# Altium schematic sheet MCU.SchDoc
size A3; SheetNumber: 6; SheetTotal: 7
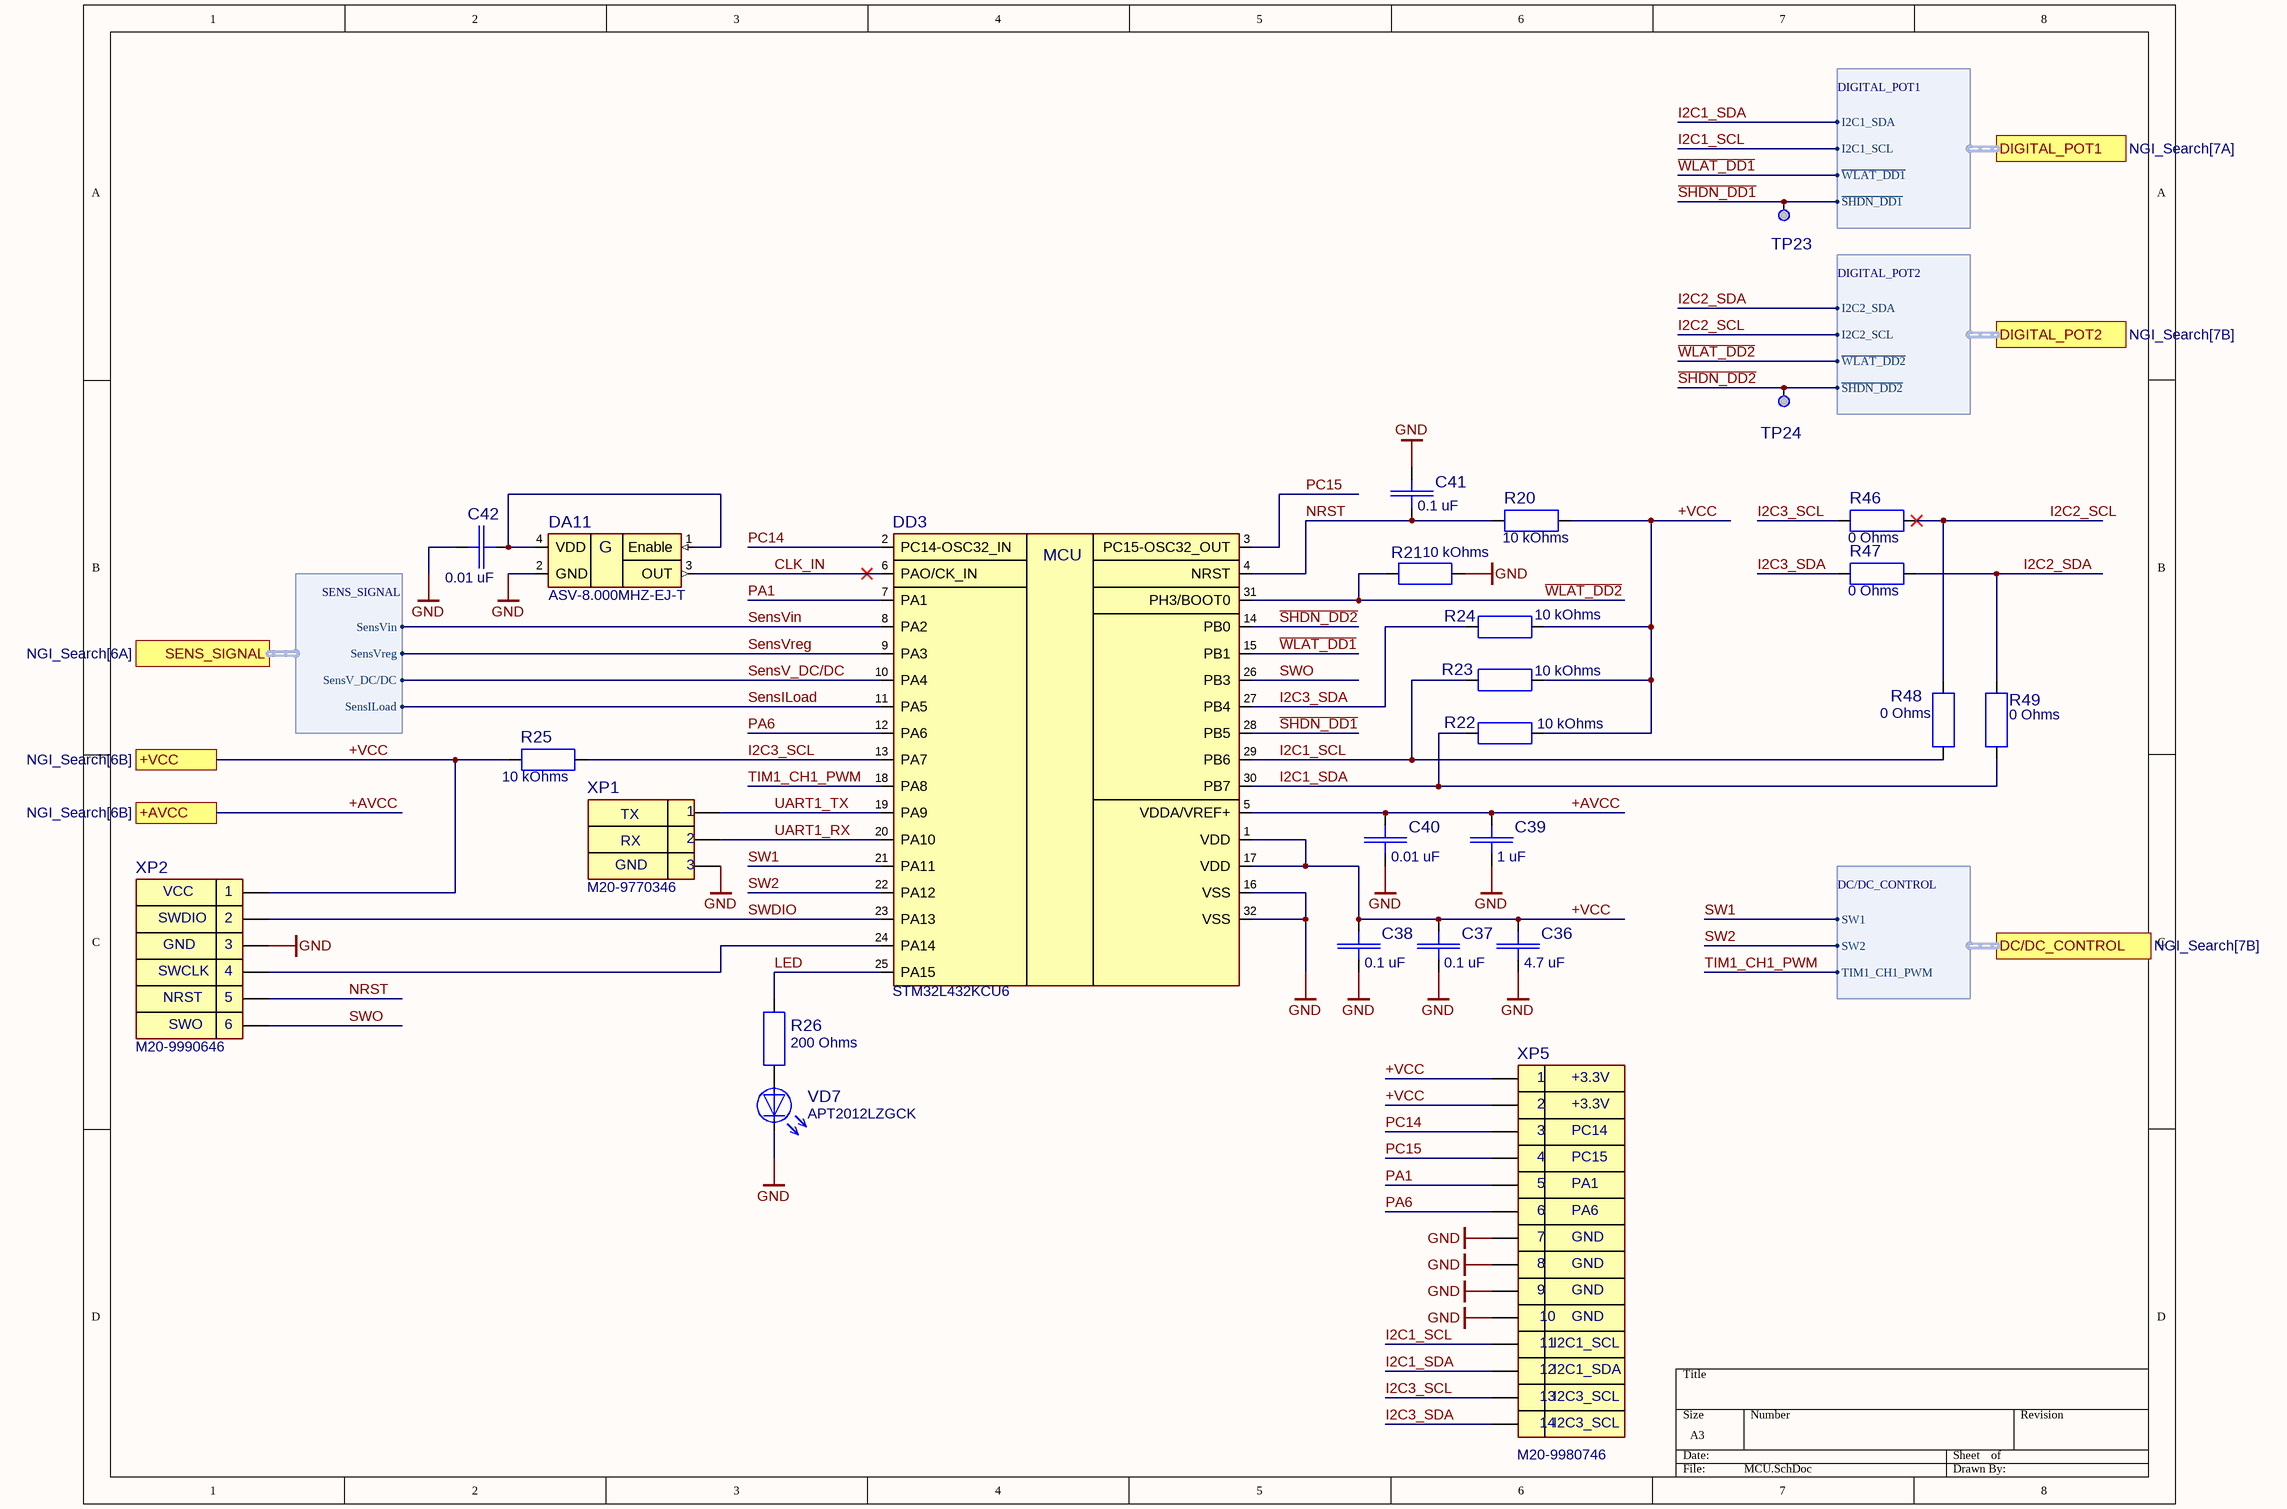
[diagram p0: MCU.SchDoc]

## Parts
C36  value 4.7 uF  [Capacitor0805_THICKNESS1.25]  (hidden comment: CL21A475KAQNNNF)
C37  value 0.1 uF  [Capacitor0805_THICKNESS0.8]  (hidden comment: CL21B104KBCNNWC)
C38  value 0.1 uF  [Capacitor0805_THICKNESS0.8]  (hidden comment: CL21B104KBCNNWC)
C39  value 1 uF  [Capacitor0805_THICKNESS1.25]  (hidden comment: CL21B105KAFNFNE)
C40  value 0.01 uF  [Capacitor0805_THICKNESS0.8]  (hidden comment: CL21B103KBANNNL)
C41  value 0.1 uF  [Capacitor0805_THICKNESS0.8]  (hidden comment: CL21B104KBCNNWC)
C42  value 0.01 uF  [Capacitor0805_THICKNESS0.8]  (hidden comment: CL21B103KBANNNL)
DA11  ASV-8.000MHZ-EJ-T  [HCMOS 7 mm x 5 mm]
DD3  STM32L432KCU6  [UFQFPN-32]
R20  value 10 kOhms  [Resistor0805_THICKNESS0.6]  (hidden comment: RC0805FR-0710KL)
R21  value 10 kOhms  [Resistor0805_THICKNESS0.6]  (hidden comment: RC0805FR-0710KL)
R22  value 10 kOhms  [Resistor0805_THICKNESS0.6]  (hidden comment: RC0805FR-0710KL)
R23  value 10 kOhms  [Resistor0805_THICKNESS0.6]  (hidden comment: RC0805FR-0710KL)
R24  value 10 kOhms  [Resistor0805_THICKNESS0.6]  (hidden comment: RC0805FR-0710KL)
R25  value 10 kOhms  [Resistor0805_THICKNESS0.6]  (hidden comment: RC0805FR-0710KL)
R26  value 200 Ohms  [Resistor0805_THICKNESS0.6]  (hidden comment: RC0805FR-10200RL)
R46  value 0 Ohms  [Resistor0805_THICKNESS0.6]  (hidden comment: RC0805FR-070RL)
R47  value 0 Ohms  [Resistor0805_THICKNESS0.6]  (hidden comment: RC0805FR-070RL)
R48  value 0 Ohms  [Resistor0805_THICKNESS0.6]  (hidden comment: RC0805FR-070RL)
R49  value 0 Ohms  [Resistor0805_THICKNESS0.6]  (hidden comment: RC0805FR-070RL)
TP23  test point  [test point]  (value not drawn)
TP24  test point  [test point]  (value not drawn)
VD7  APT2012LZGCK  [APT2012LZGCK0805_LEDs]
XP1  M20-9770346  [3 VERTICAL PIN Pitch: 2.54 mm]
XP2  M20-9990646  [6 VERTICAL PIN Pitch: 2.54 mm]
XP5  M20-9980746  [M20-9980746]

## Ports
+AVCC (see NGI_Search[6B]), +VCC (see NGI_Search[6B]), DC/DC_CONTROL (harness DC/DC_CONTROL, see NGI_Search[7B]), DIGITAL_POT1 (harness DIGITAL_POT1, see NGI_Search[7A]), DIGITAL_POT2 (harness DIGITAL_POT2, see NGI_Search[7B]), SENS_SIGNAL (harness SENS_SIGNAL, see NGI_Search[6A])

## Harnesses
DIGITAL_POT1: I2C1_SDA, I2C1_SCL, ~{WLAT_DD1}, ~{SHDN_DD1}
DIGITAL_POT2: I2C2_SDA, I2C2_SCL, ~{WLAT_DD2}, ~{SHDN_DD2}
SENS_SIGNAL: SensVin, SensVreg, SensV_DC/DC, SensILoad
DC/DC_CONTROL: SW1, SW2, TIM1_CH1_PWM

## Nets
GND: C36.1 C37.1 C38.1 C39.1 C40.1 C41.1 C42.1 DA11.2(GND) DD3.16(VSS) DD3.32(VSS) R21.2 VD7.C XP1.3 XP2.3 XP5.7 XP5.8 XP5.9 XP5.10
+AVCC: C39.2 C40.2 DD3.5(VDDA/VREF+) ; port +AVCC
+VCC: C36.2 C37.2 C38.2 DD3.1(VDD) DD3.17(VDD) R20.2 R22.1 R23.2 R24.1 R25.1 XP2.1 XP5.1 XP5.2 ; port +VCC
CLK_IN: DA11.3(OUT) DD3.6(PAO/CK_IN)
I2C1_SCL: DD3.29(PB6) R23.1 R48.1 XP5.11 ; port DIGITAL_POT1.I2C1_SCL
I2C1_SDA: DD3.30(PB7) R22.2 R49.1 XP5.12 ; port DIGITAL_POT1.I2C1_SDA
I2C2_SCL: R46.2 R48.2 ; port DIGITAL_POT2.I2C2_SCL
I2C2_SDA: R47.2 R49.2 ; port DIGITAL_POT2.I2C2_SDA
I2C3_SCL: DD3.13(PA7) R25.2 R46.1 XP5.13
I2C3_SDA: DD3.27(PB4) R24.2 R47.1 XP5.14
LED: DD3.25(PA15) R26.2
NRST: C41.2 DD3.4(NRST) R20.1 XP2.5
PA1: DD3.7(PA1) XP5.5
PA6: DD3.12(PA6) XP5.6
PC14: DD3.2(PC14-OSC32_IN) XP5.3
PC15: DD3.3(PC15-OSC32_OUT) XP5.4
~{SHDN_DD1}: DD3.28(PB5) TP23.1 ; port DIGITAL_POT1.~{SHDN_DD1}
~{SHDN_DD2}: DD3.14(PB0) TP24.1 ; port DIGITAL_POT2.~{SHDN_DD2}
SensILoad: DD3.11(PA5) ; port SENS_SIGNAL.SensILoad
SensV_DC/DC: DD3.10(PA4) ; port SENS_SIGNAL.SensV_DC/DC
SensVin: DD3.8(PA2) ; port SENS_SIGNAL.SensVin
SensVreg: DD3.9(PA3) ; port SENS_SIGNAL.SensVreg
SW1: DD3.21(PA11) ; port DC/DC_CONTROL.SW1
SW2: DD3.22(PA12) ; port DC/DC_CONTROL.SW2
SWDIO: DD3.23(PA13) XP2.2
SWO: DD3.26(PB3) XP2.6
TIM1_CH1_PWM: DD3.18(PA8) ; port DC/DC_CONTROL.TIM1_CH1_PWM
UART1_RX: DD3.20(PA10) XP1.2
UART1_TX: DD3.19(PA9) XP1.1
~{WLAT_DD1}: DD3.15(PB1) ; port DIGITAL_POT1.~{WLAT_DD1}
~{WLAT_DD2}: DD3.31(PH3/BOOT0) R21.1 ; port DIGITAL_POT2.~{WLAT_DD2}
NetC42_2: C42.2 DA11.1(Enable) DA11.4(VDD)
NetDD3_24: DD3.24(PA14) XP2.4
NetR26_1: R26.1 VD7.A

## Notes on the sheet
- TX
- RX
- (near XP2) SWDIO
- VCC
- GND
- (near XP2) SWCLK
- (near XP2) NRST
- (near XP2) SWO
- (near XP5) +3.3V
- (near XP5) PC14
- (near XP5) PC15
- (near XP5) PA1
- (near XP5) PA6
- (near XP5) GND
- (near XP5) I2C1_SCL
- (near XP5) I2C1_SDA
- (near XP5) I2C3_SCL
- (in symbol ASV-8.000MHZ-EJ-T) G
- (in symbol STM32L432KCU6) MCU

## Library data of the parts
C36 = CL21A475KAQNNNF: Multilayer Ceramic Capacitors MLCC - SMD/SMT 4.7uF+/-10% 25V X5R 0805; Manufacturer: Samsung Electro-Mechanics; Tolerance: 10%; Case: 0805; Datasheet Link: https://eu.mouser.com/datasheet/2/585/MLCC-1837944.pdf; Dielectric: X5R; ManufacturerPartNumber: CL21A475KAQNNNF; Mouser Part Number: 187-CL21A475KAQNNNF; Mouser Price/Stock: https://eu.mouser.com/ProductDetail/Samsung-Electro-Mechanics/CL21A475KAQNNNF?qs=sGAEpiMZZMvsSlwiRhF8qtsGU%2FCnaNeQ9%2FtqxdEQLsBh1lK0%252BjEvRQ%3D%3D; Power/Voltage: 25V
C37 C38 C41 = CL21B104KBCNNWC: Multilayer Ceramic Capacitors MLCC - SMD/SMT 100nF+/-10% 50V X7R 0805; Manufacturer: Samsung Electro-Mechanics; Tolerance: 10%; Dielectric: X7R; ManufacturerPartNumber: CL21B104KBCNNWC; Mouser Price/Stock: https://eu.mouser.com/ProductDetail/Samsung-Electro-Mechanics/CL21B104KBCNNWC?qs=yOVawPpwOwlu2UTVxWhmlw%3D%3D; Power/Voltage: 50V; Case: 0805; Datasheet Link: https://eu.mouser.com/datasheet/2/585/MLCC-1837944.pdf; Mouser Part Number: 187-CL21B104KBCNNWC
C39 = CL21B105KAFNFNE: Multilayer Ceramic Capacitors MLCC - SMD/SMT 1uF+/-10% 25V X7R 20 0805; Manufacturer: Samsung Electro-Mechanics; Tolerance: 10%; Case: 0805; Datasheet Link: https://eu.mouser.com/datasheet/2/585/MLCC-1837944.pdf; Dielectric: X7R; ManufacturerPartNumber: CL21B105KAFNFNE; Mouser Part Number: 187-CL21B105KAFNFNE; Mouser Price/Stock: https://eu.mouser.com/ProductDetail/Samsung-Electro-Mechanics/CL21B105KAFNFNE?qs=%252B6g0mu59x7LIqMOGGtEcpA%3D%3D; Power/Voltage: 25V
C40 C42 = CL21B103KBANNNL: Multilayer Ceramic Capacitors MLCC - SMD/SMT 10nF+/-10% 50V X7R 2 0805; Manufacturer: Samsung Electro-Mechanics; Tolerance: 10%; Case: 0805; Datasheet Link: https://eu.mouser.com/datasheet/2/585/MLCC-1837944.pdf; Dielectric: X7R; ManufacturerPartNumber: CL21B103KBANNNL; Mouser Part Number: 187-CL21B103KBANNNL; Mouser Price/Stock: https://eu.mouser.com/ProductDetail/Samsung-Electro-Mechanics/CL21B103KBANNNL?qs=sGAEpiMZZMvsSlwiRhF8qtsGU%2FCnaNeQUbGZYi74bLm5gwqVLR8V4A%3D%3D; Power/Voltage: 50V
DA11 = ASV-8.000MHZ-EJ-T: Standard Clock Oscillators XTAL OSC XO 8.0000MHZ HCMOS SMD; Manufacturer: ABRACON; Value: 8 Mhz; Case: HCMOS 7 mm x 5 mm; Datasheet Link: https://eu.mouser.com/datasheet/2/3/ASV-3106233.pdf; ManufacturerPartNumber: ASV-8.000MHZ-EJ-T; Mouser Part Number: 815-ASV-8-EJ-T; Mouser Price/Stock: https://eu.mouser.com/ProductDetail/ABRACON/ASV-8.000MHZ-EJ-T?qs=2xLVn2jvFusvDzqul0mkiw%3D%3D
DD3 = STM32L432KCU6: ARM Microcontrollers - MCU Ultra-low-power FPU Arm Cortex-M4 MCU 80 MHz 256 Kbytes of Flash , USB; Manufacturer: STMicroelectronics; Case: UFQFPN-32; Datasheet Link: https://eu.mouser.com/datasheet/2/389/stm32l432kb-1851151.pdf; ManufacturerPartNumber: STM32L432KCU6; Mouser Part Number: 511-STM32L432KCU6; Mouser Price/Stock: https://eu.mouser.com/ProductDetail/STMicroelectronics/STM32L432KCU6?qs=dTJS0cRn7oiybcTRwI97Tw%3D%3D
R20-R25 = RC0805FR-0710KL: Thick Film Resistors 10 kOhms 125 mW 0805 1%; Manufacturer: YAGEO; Power/Voltage: 125 mW / 150V; Case: 0805; Datasheet Link: https://eu.mouser.com/datasheet/2/447/YAGEO_PYu_RC_Group_51_RoHS_L_12-3313492.pdf; ManufacturerPartNumber: RC0805FR-0710KL; Mouser Part Number: 603-RC0805FR-0710KL; Mouser Price/Stock: https://eu.mouser.com/ProductDetail/YAGEO/RC0805FR-0710KL?qs=sGAEpiMZZMvdGkrng054txdMlaQGj9fi4uZGpN02qIo%3D; Tolerance: 1%
R26 = RC0805FR-10200RL: Thick Film Resistors 200Ohms 1/8W 0805 1%; Manufacturer: YAGEO; Power/Voltage: 125 mW / 150V; Case: 0805; Datasheet Link: https://www.yageo.com/upload/media/product/productsearch/datasheet/rchip/PYu-RC_Group_51_RoHS_L_12.pdf; ManufacturerPartNumber: RC0805FR-10200RL; Mouser Price/Stock: https://eu.mouser.com/ProductDetail/YAGEO/RC0805FR-10200RL?qs=sGAEpiMZZMvdGkrng054t7z4BkURc4LzuHPKHxVOSmZu%252BG%252BXJlK7UA%3D%3D; Tolerance: 1%; Mouser Part Number: 603-RC0805FR-10200RL
R46-R49 = RC0805FR-070RL: Thick Film Resistors 0 Ohms 125 mW 0805 1%; Manufacturer: YAGEO; Power/Voltage: 125 mW / 150V; Case: 0805; Datasheet Link: https://eu.mouser.com/datasheet/2/447/YAGEO_PYu_RC_Group_51_RoHS_L_12-3313492.pdf; ManufacturerPartNumber: RC0805FR-070RL; Mouser Part Number: 603-RC0805FR-070RL; Mouser Price/Stock: https://eu.mouser.com/ProductDetail/YAGEO/RC0805FR-070RL?qs=sGAEpiMZZMvdGkrng054tx7%2F6%252BNA3LAJ3XU3yVJUh88%3D; Tolerance: 1%
VD7 = APT2012LZGCK: Standard LEDs - SMD 2.0X1.2MM LOW CRNT; Manufacturer: Kingbright; Case: 0805; ManufacturerPartNumber: APT2012LZGCK; Mouser Part Number: 604-APT2012LZGCK; Mouser Price/Stock: https://eu.mouser.com/ProductDetail/Kingbright/APT2012LZGCK?qs=6oMev5NRZMHOosFiXb%2F3qw%3D%3D; Datasheet Link: https://eu.mouser.com/datasheet/2/216/APT2012LZGCK-535687.pdf
XP1 = M20-9770346: Headers & Wire Housings 03 SIL VERTICAL PIN HEADER TIN; Manufacturer: Harwin; Case: 3 VERTICAL PIN Pitch: 2.54 mm; Datasheet Link: https://eu.mouser.com/datasheet/2/181/M20-977-1220590.pdf; ManufacturerPartNumber: M20-9770346; Mouser Part Number: 855-M20-9770346; Mouser Price/Stock: https://eu.mouser.com/ProductDetail/Harwin/M20-9770346?qs=Jph8NoUxIfVn3Cgrvt8MYw%3D%3D
XP2 = M20-9990646: Headers & Wire Housings 06 SIL VERTICAL PIN HEADER TIN; Manufacturer: Harwin; Case: 6 VERTICAL PIN Pitch: 2.54 mm; Datasheet Link: https://eu.mouser.com/datasheet/2/181/M20-999-1218971.pdf; ManufacturerPartNumber: M20-9990646; Mouser Part Number: M20-9990646; Mouser Price/Stock: https://eu.mouser.com/ProductDetail/Harwin/M20-9990646?qs=Jph8NoUxIfXDcWZbabSSiw%3D%3D
XP5 = M20-9980746: Headers & Wire Housings 07+07 DIL VERTICAL PIN HEADER TIN; Manufacturer: Harwin; Case: 07+07 DIL VERTICAL PIN; Datasheet Link: https://eu.mouser.com/datasheet/2/181/M20-998-1220570.pdf; ManufacturerPartNumber: M20-9980746; Mouser Part Number: 855-M20-9980746; Mouser Price/Stock: https://eu.mouser.com/ProductDetail/Harwin/M20-9980746?qs=%252Bk6%2F5FB6qrksRad0BXV2Qw%3D%3D